# Altium project MiniFrogFC_v1.PrjPcb
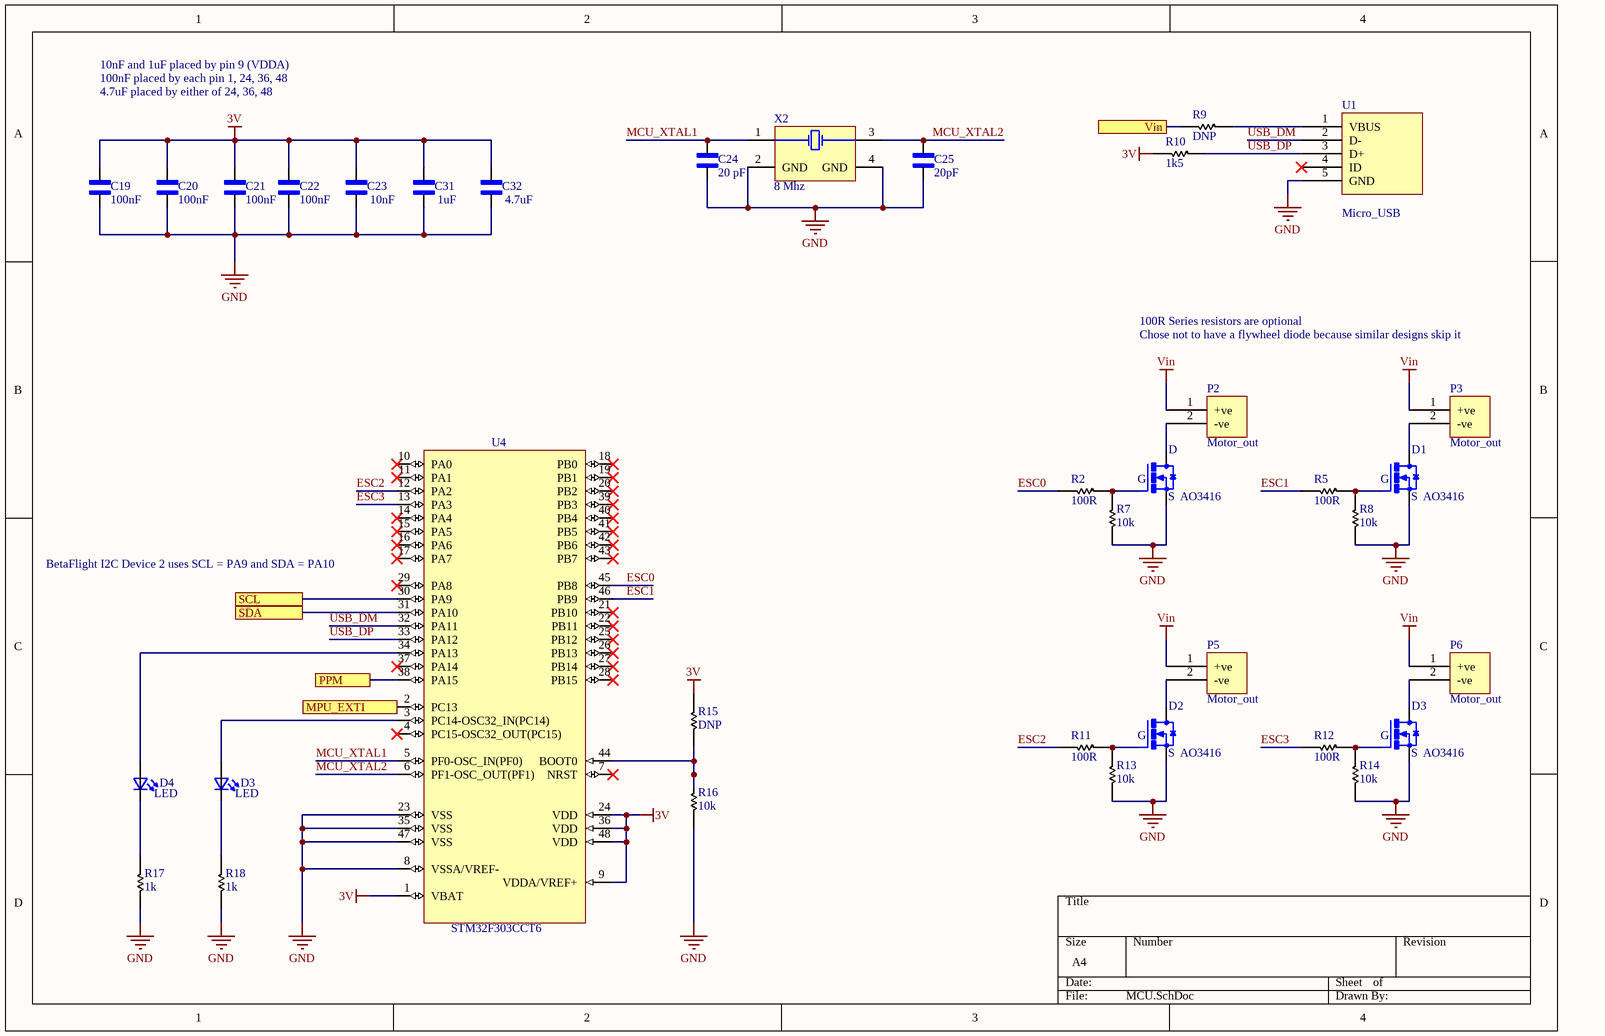
[diagram p0: MCU.SchDoc]
4 sheets, 86 parts. Net scope: flat (ports and power ports of the same name join across sheets).
Board file: MiniFrogFC_v1.PcbDoc
Sheets:
  MCU.SchDoc
  Receiver.SchDoc
  IMU.SchDoc
  Power.SchDoc

## Sheet MCU.SchDoc
size A4

### Parts
1  AO3416  [SOT23-3]
2  AO3416  [SOT23-3]
3  AO3416  [SOT23-3]
C19  100nF  [0402 Capacitor Generic]
C20  100nF  [0402 Capacitor Generic]
C21  100nF  [0402 Capacitor Generic]
C22  100nF  [0402 Capacitor Generic]
C23  10nF  [0402 Capacitor Generic]
C24  20 pF  [0402 Capacitor Generic]
C25  20pF  [0402 Capacitor Generic]
C31  1uF  [0402 Capacitor Generic]
C32  4.7uF  [0402 Capacitor Generic]
D3  LED  [0402 LED Generic]
D4  LED  [0402 LED Generic]
P2  Motor_out  [MOLEX_530470210]
P3  Motor_out  [MOLEX_530470210]
P5  Motor_out  [MOLEX_530470210]
P6  Motor_out  [MOLEX_530470210]
R2  100R  [0402 Resistor Generic]
R5  100R  [0402 Resistor Generic]
R7  10k  [0402 Resistor Generic]
R8  10k  [0402 Resistor Generic]
R9  DNP  [0402 Resistor Generic]
R10  1k5  [0402 Resistor Generic]
R11  100R  [0402 Resistor Generic]
R12  100R  [0402 Resistor Generic]
R13  10k  [0402 Resistor Generic]
R14  10k  [0402 Resistor Generic]
R15  DNP  [0402 Resistor Generic]
R16  10k  [0402 Resistor Generic]
R17  1k  [0402 Resistor Generic]
R18  1k  [0402 Resistor Generic]
U1  Micro_USB  [U254-051T-4BH83-F1S]
U4  STM32F303CCT6  [STM-LQFP48_N]
X2  8 Mhz  [TSX-3225]
  AO3416  [SOT23-3]

### Ports
MPU_EXTI, PPM, SCL, SDA, Vin

### Nets
3V: C19.1 C20.1 C21.1 C22.1 C23.1 C31.1 C32.1 R10.1 R15.1 U4.1(VBAT) U4.9(VDDA/VREF+) U4.24(VDD) U4.36(VDD) U4.48(VDD)
GND: 1.2(S) 2.2(S) 3.2(S) C19.2 C20.2 C21.2 C22.2 C23.2 C24.2 C25.2 C31.2 C32.2 R7.2 R8.2 R13.2 R14.2 R16.2 R17.2 R18.2 U1.5(GND) U4.8(VSSA/VREF-) U4.23(VSS) U4.35(VSS) U4.47(VSS) X2.2(GND) X2.4(GND) .2(S)
Vin: P2.1(+ve) P3.1(+ve) P5.1(+ve) P6.1(+ve) R9.1 ; port Vin
ESC0: R2.1 U4.45(PB8)
ESC1: R5.1 U4.46(PB9)
ESC2: R11.1 U4.12(PA2)
ESC3: R12.1 U4.13(PA3)
MCU_XTAL1: C24.1 U4.5(PF0-OSC_IN(PF0)) X2.1(X1)
MCU_XTAL2: C25.1 U4.6(PF1-OSC_OUT(PF1)) X2.3(X2)
PPM: U4.38(PA15) ; port PPM
SCL: U4.30(PA9) ; port SCL
SDA: U4.31(PA10) ; port SDA
USB_DM: U1.2(D-) U4.32(PA11)
USB_DP: R10.2 U1.3(D+) U4.33(PA12)
Net1_1: 1.1(G) R5.2 R8.1
Net1_3: 1.3(D) P3.2(-ve)
Net2_1: 2.1(G) R11.2 R13.1
Net2_3: 2.3(D) P5.2(-ve)
Net3_1: 3.1(G) R12.2 R14.1
Net3_3: 3.3(D) P6.2(-ve)
NetD3_1: D3.1(K2) R18.1
NetD3_2: D3.2(A2) U4.3(PC14-OSC32_IN(PC14))
NetD4_1: D4.1(K2) R17.1
NetD4_2: D4.2(A2) U4.34(PA13)
NetP2_2: P2.2(-ve) .3(D)
NetR2_2: R2.2 R7.1 .1(G)
NetR9_2: R9.2 U1.1(VBUS)
NetR15_2: R15.2 R16.1 U4.44(BOOT0)
NetU_12: U4.2(PC13) ; port MPU_EXTI

Not connected (* = marked no-connect by the designer): U1 4(ID)*; U4 4(PC15-OSC32_OUT(PC15))* 7(NRST)* 10(PA0)* 11(PA1)* 14(PA4)* 15(PA5)* 16(PA6)* 17(PA7)* 18(PB0)* 19(PB1)* 20(PB2)* 21(PB10)* 22(PB11)* 25(PB12)* 26(PB13)* 27(PB14)* 28(PB15)* 29(PA8)* 37(PA14)* 39(PB3)* 40(PB4)* 41(PB5)* 42(PB6)* 43(PB7)*

### Notes on the sheet
- 10nF and 1uF placed by pin 9 (VDDA)
- 100nF placed by each pin 1, 24, 36, 48
- 4.7uF placed by either of 24, 36, 48
- Chose not to have a flywheel diode because similar designs skip it
- 100R Series resistors are optional
- BetaFlight I2C Device 2 uses SCL = PA9 and SDA = PA10

### Library data of the parts
1-3  = AO3416: N-Channel 20V 6.5A _Ta_ 1.4W _Ta_ Surface Mount SOT-23-3L; MF: Alpha &; Digi-Key_Part_Number: 785-1011-1-ND; Package: SOT-23 Alpha &amp; Omega Semiconductor; MP: AO3416; Value: *; SnapEDA_Link: https://www.snapeda.com/parts/AO3416/Alpha%20%26%20Omega%20Semiconductor%20Inc./view-part/555673/?ref=snap; Digi-Key_Purchase_URL: https://www.digikey.com/product-detail/en/alpha-omega-semiconductor-inc/AO3416/785-1011-1-ND/1855953?utm_source=snapeda&utm_medium=aggregator&utm_campaign=symbol
C19-C25 C31 C32 = 0402 Ceramic Capacitor: Generic 0402 Ceramic Capacitor; MP: AC0402FR-071ML; MF: Yageo; Package: 1005 Yageo; SnapEDA_Link: https://www.snapeda.com/parts/AC0402FR-071ML/Yageo/view-part/940461/?ref=snap; Value: *; Mouser-Purchase-URL: https://snapeda.com/shop?store=Mouser&id=940461; DigiKey-Purchase-URL: https://snapeda.com/shop?store=DigiKey&id=940461
D3 D4 = 0402 Generic LED: Value: *
R2 R5 R7 R8 R10-R18 = 0402 Generic Resistor: Generic 0402 Resistor
R9 = 0402 Generic Resistor: Do Not Place
U1 = Micro_USB: XKB Connectivity U254-051T-4BH83-F1S
U4 = STM32F303CCT6: MCU 32-bit STM32F ARM Cortex M4 RISC 256KB Flash 2.5V/3.3V 48-Pin LQFP Tray; Manufacturer: STMicroelectronics; Number of I/Os: 37; Interface: I2C,SPI,USB,CAN,IrDA,UART,USART,LIN,I2S; Frequency: 72MHz; RAM Size: 40KB; Number of Timers/Counters: 10; Oscillator Type: Internal; Number of Programmable I/O: 27; Data Bus Width: 32b; Watchdog Timer: Yes; Peripherals: POR,PWM,WDT,DMA; Max Supply Voltage: 3.6V; Min Supply Voltage: 2V; Number of ADC Channels: 39; Number of SPI Channels: 3; Number of I2C Channels: 2; Number of USB Channels: 1; Supplier 1: Digi-Key; Manufacturer Part Number: STM32F303CCT6; RoHS: Yes; Category: Microcontrollers; Stock 1: 6096; Pricing 1: 1=6.33000, 10=5.68700, 25=5.37600, 100=4.65930, 250=4.42040, 500=3.96640, 1000=3.34516, 2500=3.17790, 5000=3.05843 (USD); Case/Package: LQFP; Number of Pins: 48; Contact Plating: Gold; Min Operating Temperature: -40°C; Max Operating Temperature: 85°C; Packaging: Tray; Max Frequency: 72MHz; Memory Type: FLASH; Memory Size: 256KB; Core Architecture: ARM; Package Quantity: 250; Length: 10mm; Height: 1.45mm; Width: 7.2mm; Radiation Hardening: No; Lead Free: Lead Free; REACH SVHC: No SVHC; ComponentLink1URL: https://datasheet.ciiva.com/14666/0900766b81171360-14666656.pdf?src-supplier=RSComponents; ComponentLink1Description: https://datasheet.ciiva.com/14666/0900766b81171360-14666656.pdf?src-supplier=RSComponents; ComponentLink2URL: https://datasheet.ciiva.com/8055/1831499-8055015.pdf?src-supplier=Element14; ComponentLink2Description: https://datasheet.ciiva.com/8055/1831499-8055015.pdf?src-supplier=Element14; Supplier Part Number 1: 497-13318-ND
X2 = XTY 7325-0800A2010-00: 8MHz ±10ppm 20pF 400Ω; ComponentLink1URL: https://support.epson.biz/td/api/doc_check.php?dl=brief_FA-238V_en.pdf&src-supplier=Digi-Key; ComponentLink1Description: https://support.epson.biz/td/api/doc_check.php?dl=brief_FA-238V_en.pdf&src-supplier=Digi-Key

## Sheet Receiver.SchDoc
size A4
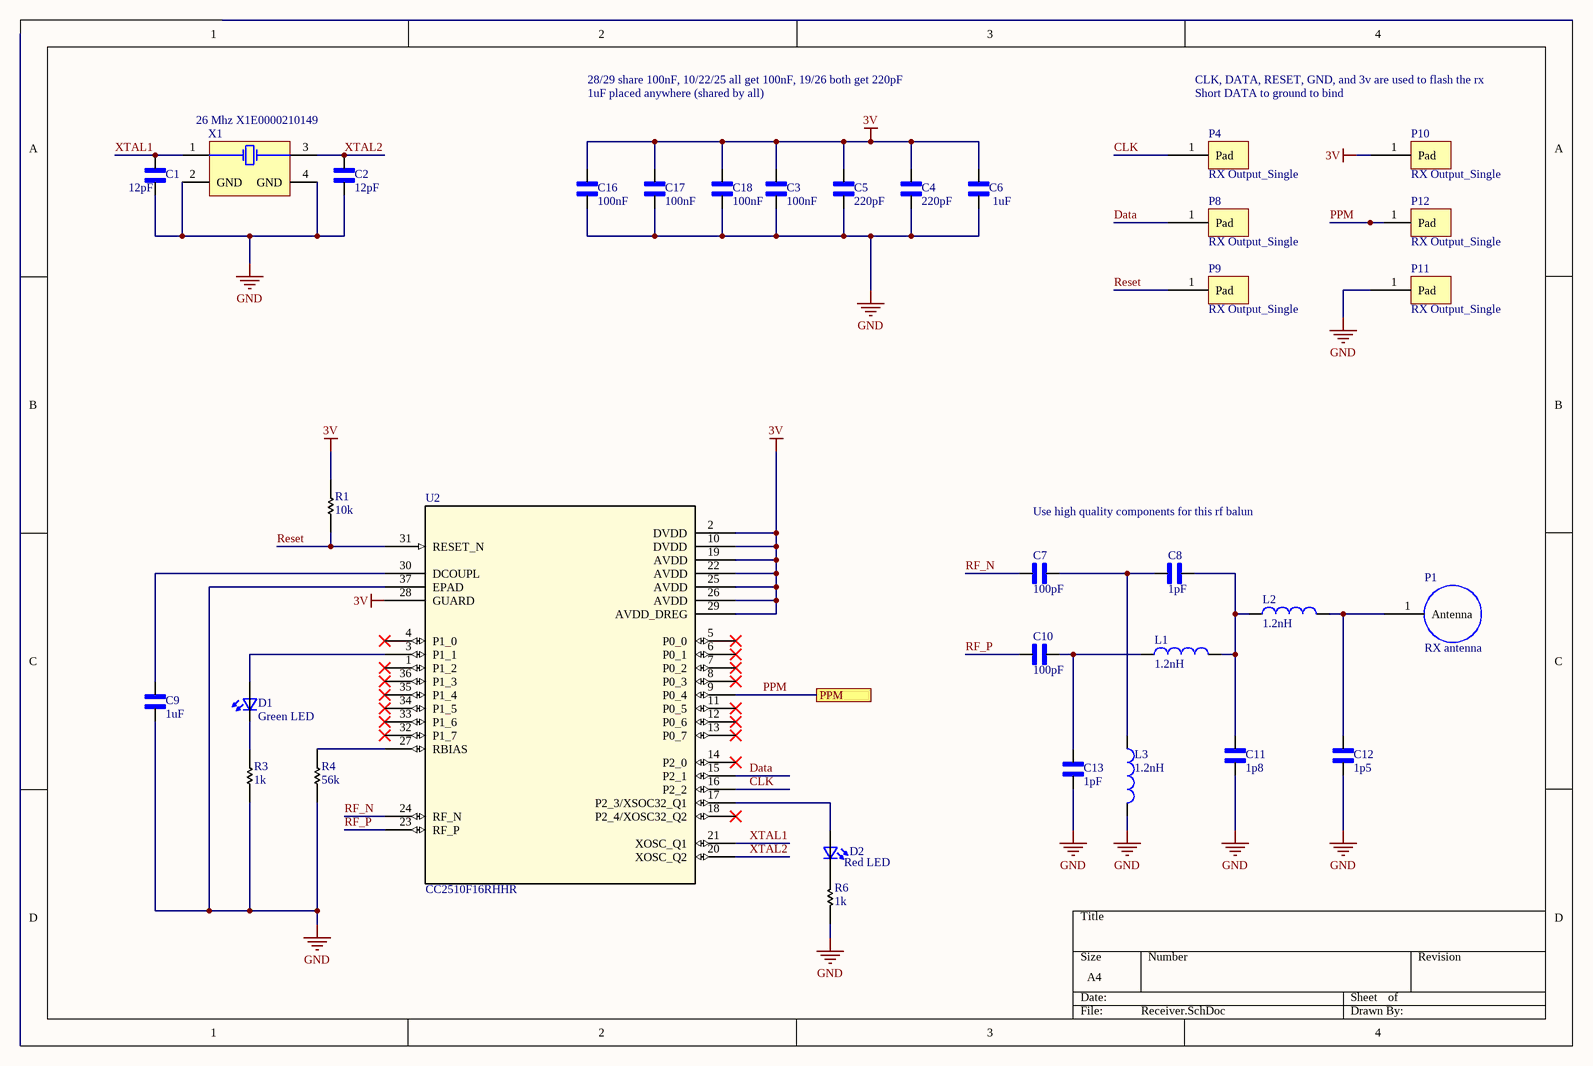
[diagram p1: Receiver.SchDoc]

### Parts
C1  12pF  [0402 Capacitor Generic]
C2  12pF  [0402 Capacitor Generic]
C3  100nF  [0402 Capacitor Generic]
C4  220pF  [0402 Capacitor Generic]
C5  220pF  [0402 Capacitor Generic]
C6  1uF  [0402 Capacitor Generic]
C7  100pF  [0402 Capacitor Generic]
C8  1pF  [0402 Capacitor Generic]
C9  1uF  [0402 Capacitor Generic]
C10  100pF  [0402 Capacitor Generic]
C11  1p8  [0402 Capacitor Generic]
C12  1p5  [0402 Capacitor Generic]
C13  1pF  [0402 Capacitor Generic]
C16  100nF  [0402 Capacitor Generic]
C17  100nF  [0402 Capacitor Generic]
C18  100nF  [0402 Capacitor Generic]
D1  Green LED  [0402 LED Generic]
D2  Red LED  [0402 LED Generic]
L1  1.2nH  [0402 Inductor Generic]
L2  1.2nH  [0402 Inductor Generic]
L3  1.2nH  [0402 Inductor Generic]
P1  RX antenna  [Antenna pad]
P4  RX Output_Single  [1 Solder Pad]
P8  RX Output_Single  [1 Solder Pad]
P9  RX Output_Single  [1 Solder Pad]
P10  RX Output_Single  [1 Solder Pad]
P11  RX Output_Single  [1 Solder Pad]
P12  RX Output_Single  [1 Solder Pad]
R1  10k  [0402 Resistor Generic]
R3  1k  [0402 Resistor Generic]
R4  56k  [0402 Resistor Generic]
R6  1k  [0402 Resistor Generic]
U2  CC2510F16RHHR  [CC2510F32RHHR]
X1  26 Mhz X1E0000210149  [TSX-3225]

### Ports
PPM

### Nets
3V: C3.1 C4.1 C5.1 C6.1 C16.1 C17.1 C18.1 P10.1(Pad) R1.1 U2.2(DVDD) U2.10(DVDD) U2.19(AVDD) U2.22(AVDD) U2.25(AVDD) U2.26(AVDD) U2.28(GUARD) U2.29(AVDD_DREG)
GND: C1.2 C2.2 C3.2 C4.2 C5.2 C6.2 C9.2 C11.2 C12.2 C13.2 C16.2 C17.2 C18.2 L3.2 P11.1(Pad) R3.2 R4.2 R6.2 U2.37(EPAD) X1.2(GND) X1.4(GND)
CLK: P4.1(Pad) U2.16(P2_2)
Data: P8.1(Pad) U2.15(P2_1)
PPM: P12.1(Pad) U2.9(P0_4) ; port PPM
Reset: P9.1(Pad) R1.2 U2.31(RESET_N)
RF_N: C7.2 U2.24(RF_N)
RF_P: C10.2 U2.23(RF_P)
XTAL1: C1.1 U2.21(XOSC_Q1) X1.1(X1)
XTAL2: C2.1 U2.20(XOSC_Q2) X1.3(X2)
NetC7_1: C7.1 C8.1 L3.1
NetC8_2: C8.2 C11.1 L1.2 L2.1
NetC9_1: C9.1 U2.30(DCOUPL)
NetC10_1: C10.1 C13.1 L1.1
NetC12_1: C12.1 L2.2 P1.1(Antenna)
NetD1_1: D1.1(K2) R3.1
NetD1_2: D1.2(A2) U2.3(P1_1)
NetD2_1: D2.1(K2) R6.1
NetD2_2: D2.2(A2) U2.17(P2_3/XSOC32_Q1)
NetR4_1: R4.1 U2.27(RBIAS)

Not connected (* = marked no-connect by the designer): U2 1(P1_2)* 4(P1_0)* 5(P0_0)* 6(P0_1)* 7(P0_2)* 8(P0_3)* 11(P0_5)* 12(P0_6)* 13(P0_7)* 14(P2_0)* 18(P2_4/XOSC32_Q2)* 32(P1_7)* 33(P1_6)* 34(P1_5)* 35(P1_4)* 36(P1_3)*

### Notes on the sheet
- 28/29 share 100nF, 10/22/25 all get 100nF, 19/26 both get 220pF
- 1uF placed anywhere (shared by all)
- CLK, DATA, RESET, GND, and 3v are used to flash the rx
- Short DATA to ground to bind
- Use high quality components for this rf balun

### Library data of the parts
C1-C13 C16-C18 = 0402 Ceramic Capacitor: as C19 on sheet MCU; Package: 1005 Yageo; SnapEDA_Link: https://www.snapeda.com/parts/AC0402FR-071ML/Yageo/view-part/940461/?ref=snap; Value: *; Mouser-Purchase-URL: https://snapeda.com/shop?store=Mouser&id=940461; DigiKey-Purchase-URL: https://snapeda.com/shop?store=DigiKey&id=940461
D1 D2 = 0402 Generic LED: Value: *
L1-L3 = 0402 Generic Inductor: Value: *
P1 = Generic Antenna
R1 R3 R4 R6 = 0402 Generic Resistor: Generic 0402 Resistor
U2 = CC2510F16RHHR: VQFN-36 RF Transceiver ICs; SourceLibrary: TI_2019-05-10; Vendor: Texas Instruments; Manufacturer_Part_Number: CC2510F16RHHR; RefDes: RefDes; Type: DEV
X1 = X1E0000210149: 26MHz ±10ppm 12pF 40Ω TSX-3225; Manufacturer: Epson; ESR (Equivalent Series Resistance): 40R; Supplier 1: Digi-Key; RoHS: Yes; Category: Crystals; Pricing 1: 2000=0.17600 (USD); Mount: Surface Mount; Case/Package: SMD/SMT; Min Operating Temperature: -20°C; Max Operating Temperature: 75°C; Packaging: Tape and Reel; Frequency: 26MHz; Load Capacitance: 12pF; Frequency Stability: 10ppm; Frequency Tolerance: 10ppm; Length: 0.126inch; Height: 0.024inch; Width: 0.098inch; ComponentLink1URL: https://support.epson.biz/td/api/doc_check.php?dl=brief_FA-238V_en.pdf&src-supplier=Digi-Key; ComponentLink1Description: https://support.epson.biz/td/api/doc_check.php?dl=brief_FA-238V_en.pdf&src-supplier=Digi-Key

## Sheet IMU.SchDoc
size A4
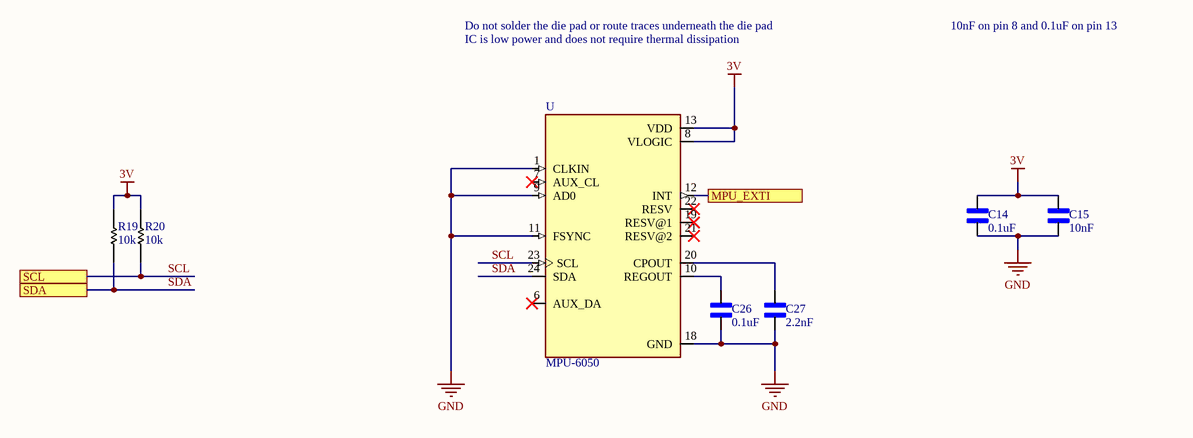
[diagram p2: IMU.SchDoc]

### Parts
C14  0.1uF  [0402 Capacitor Generic]
C15  10nF  [0402 Capacitor Generic]
C26  0.1uF  [0402 Capacitor Generic]
C27  2.2nF  [0402 Capacitor Generic]
R19  10k  [0402 Resistor Generic]
R20  10k  [0402 Resistor Generic]
U  MPU-6050  [MPU-6050]

### Ports
MPU_EXTI, SCL, SDA

### Nets
3V: C14.1 C15.1 R19.1 R20.1 U.8(VLOGIC) U.13(VDD)
GND: C14.2 C15.2 C26.2 C27.2 U.1(CLKIN) U.9(AD0) U.11(FSYNC) U.18(GND)
SCL: R20.2 U.23(SCL) ; port SCL
SDA: R19.2 U.24(SDA) ; port SDA
NetC26_1: C26.1 U.10(REGOUT)
NetC27_1: C27.1 U.20(CPOUT)
NetU_12: U.12(INT) ; port MPU_EXTI

Not connected (* = marked no-connect by the designer): U 6(AUX_DA)* 7(AUX_CL)* 19(RESV@1)* 21(RESV@2)* 22(RESV)*

### Notes on the sheet
- Do not solder the die pad or route traces underneath the die pad
- IC is low power and does not require thermal dissipation
- 10nF on pin 8 and 0.1uF on pin 13

### Library data of the parts
C14 C15 C26 C27 = 0402 Ceramic Capacitor: as C19 on sheet MCU; Package: 1005 Yageo; SnapEDA_Link: https://www.snapeda.com/parts/AC0402FR-071ML/Yageo/view-part/940461/?ref=snap; Value: *; Mouser-Purchase-URL: https://snapeda.com/shop?store=Mouser&id=940461; DigiKey-Purchase-URL: https://snapeda.com/shop?store=DigiKey&id=940461
R19 R20 = 0402 Generic Resistor: Generic 0402 Resistor
U = MPU-6050: Accelerometer, Gyroscope, 6 Axis Sensor IÂ²C Output; MF: TDK InvenSense; Price: None; Package: VFQFN-24 TDK InvenSense; MP: MPU-6050; Value: *; Availability: Unavailable; SnapEDA_Link: https://www.snapeda.com/parts/MPU-6050/TDK%20InvenSense/view-part/4503180/?ref=snap

## Sheet Power.SchDoc
size A4
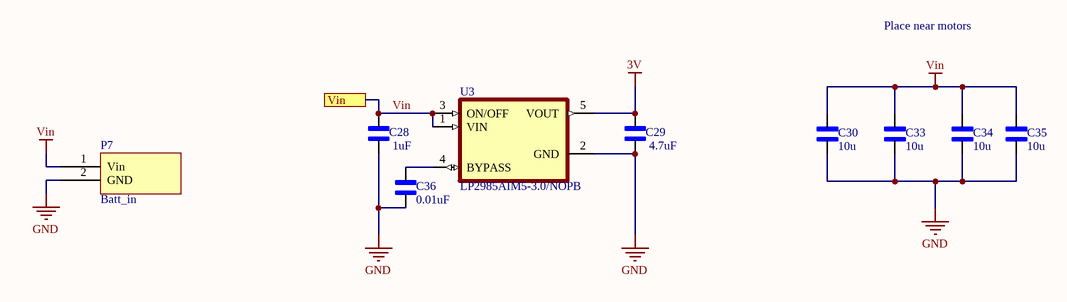
[diagram p3: Power.SchDoc]

### Parts
C28  1uF  [0402 Capacitor Generic]
C29  4.7uF  [0402 Capacitor Generic]
C30  10u  [0402 Capacitor Generic]
C33  10u  [0402 Capacitor Generic]
C34  10u  [0402 Capacitor Generic]
C35  10u  [0402 Capacitor Generic]
C36  0.01uF  [0402 Capacitor Generic]
P7  Batt_in  [2 Solder Pads]
U3  LP2985AIM5-3.0/NOPB  [SOT-23]

### Ports
Vin

### Nets
3V: C29.1 U3.5(VOUT)
GND: C28.2 C29.2 C30.2 C33.2 C34.2 C35.2 C36.1 P7.2(GND) U3.2(GND)
Vin: C28.1 C30.1 C33.1 C34.1 C35.1 P7.1(Vin) U3.1(VIN) U3.3(ON/OFF) ; port Vin
NetC36_2: C36.2 U3.4(BYPASS)

### Notes on the sheet
- Place near motors

### Library data of the parts
C28-C30 C33-C36 = 0402 Ceramic Capacitor: as C19 on sheet MCU; Package: 1005 Yageo; SnapEDA_Link: https://www.snapeda.com/parts/AC0402FR-071ML/Yageo/view-part/940461/?ref=snap; Value: *; Mouser-Purchase-URL: https://snapeda.com/shop?store=Mouser&id=940461; DigiKey-Purchase-URL: https://snapeda.com/shop?store=DigiKey&id=940461
U3 = LP2985AIM5-3.0/NOPB: Fixed 3V LDO (16V MAX) 150mA SOT-23-5 Linear Voltage Regulator

## Nets that join several sheets
3V: MCU (14 pins), Receiver (17 pins), IMU (6 pins), Power (C29.1 U3.5)
GND: MCU (27 pins), Receiver (21 pins), IMU (8 pins), Power (9 pins)
Vin: MCU (5 pins), Power (8 pins)
NetU_12: MCU (U4.2), IMU (U.12)
PPM: MCU (U4.38), Receiver (P12.1 U2.9)
SCL: MCU (U4.30), IMU (R20.2 U.23)
SDA: MCU (U4.31), IMU (R19.2 U.24)